# Altium schematic sheet Bridge.SchDoc
size A4
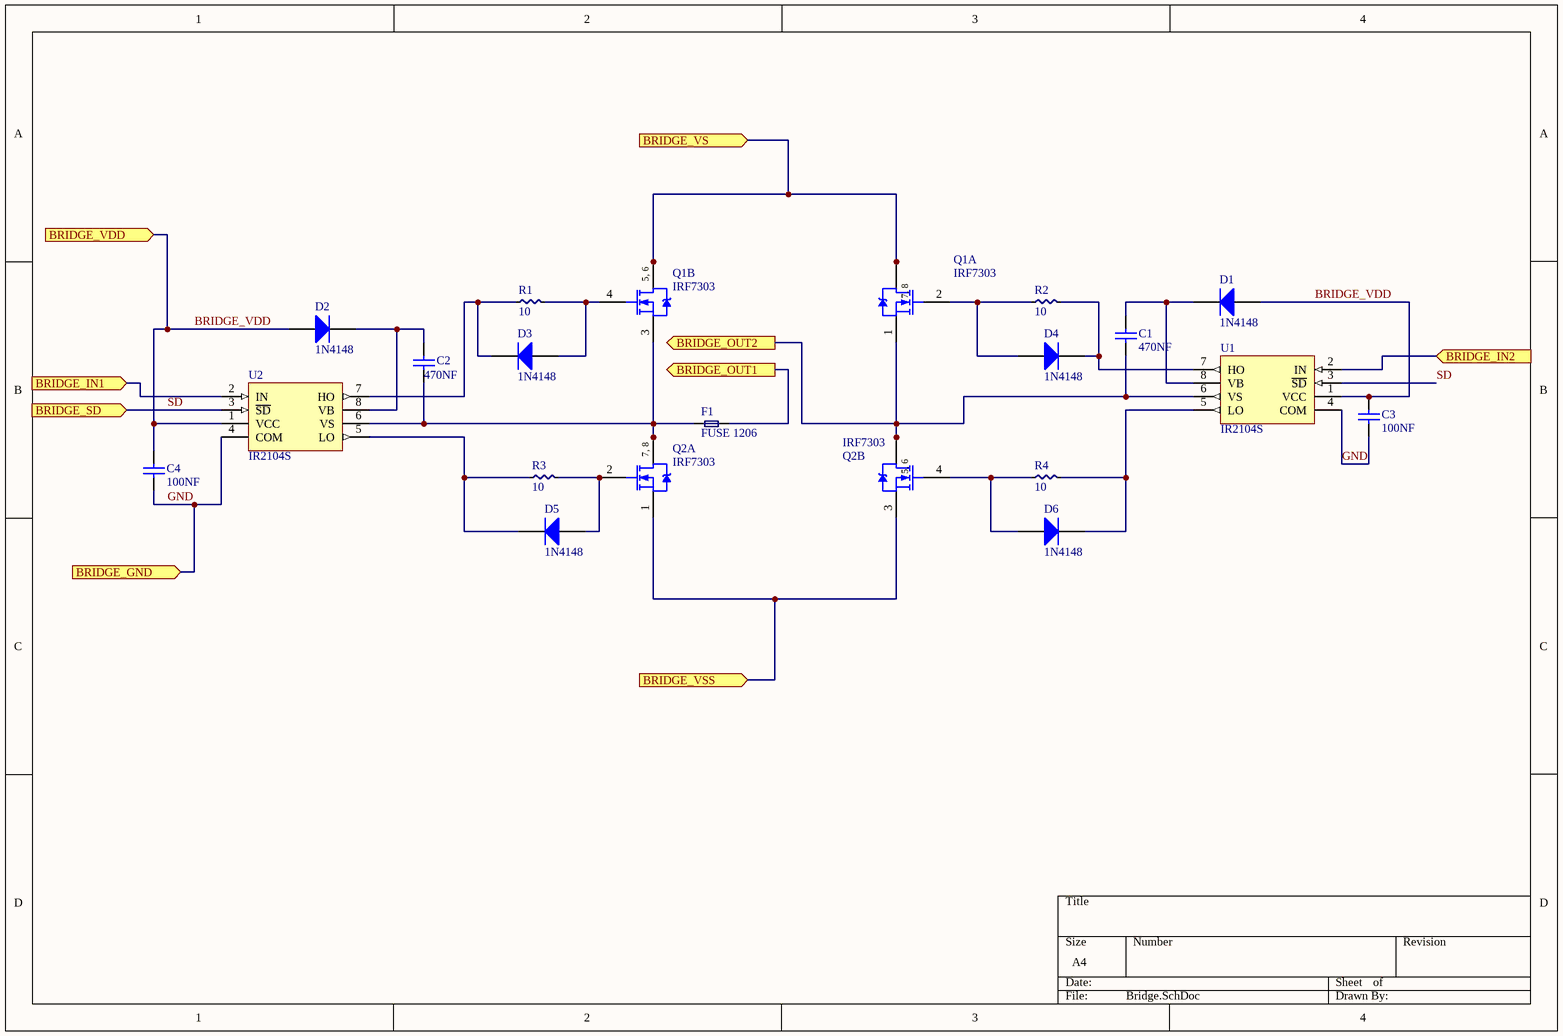
[diagram p0: Bridge.SchDoc]

## Parts
C1  470NF  [MY_CAP_SMD_1206]
C2  470NF  [MY_CAP_SMD_1206]
C3  100NF  [MY_CAP_SMD_0805]
C4  100NF  [MY_CAP_SMD_0805]
D1  1N4148  [MY_DIOD1N5822_SMD]
D2  1N4148  [MY_DIOD1N5822_SMD]
D3  1N4148  [MY_DIOD1N5822_SMD]
D4  1N4148  [MY_DIOD1N5822_SMD]
D5  1N4148  [MY_DIOD1N5822_SMD]
D6  1N4148  [MY_DIOD1N5822_SMD]
F1  FUSE 1206  [FUSE1206]
Q1  IRF7303  [SO-8_N]  (parts A,B of 2)
Q2  IRF7303  [SO-8_N]  (parts A,B of 2)
R1  10  [MY_RES_SMD_0805]
R2  10  [MY_RES_SMD_0805]
R3  10  [MY_RES_SMD_0805]
R4  10  [MY_RES_SMD_0805]
U1  IR2104S  [SO-8_N]
U2  IR2104S  [SO-8_N]

## Ports
BRIDGE_GND (in), BRIDGE_IN1 (in), BRIDGE_IN2 (in), BRIDGE_OUT1 (out), BRIDGE_OUT2 (out), BRIDGE_SD (in), BRIDGE_VDD (in), BRIDGE_VS (in), BRIDGE_VSS (in)

## Nets
BRIDGE_IN1: U2.2(IN) ; port BRIDGE_IN1
BRIDGE_IN2: U1.2(IN) ; port BRIDGE_IN2
BRIDGE_OUT1: F1.1 ; port BRIDGE_OUT1
BRIDGE_OUT2: C1.1 Q1.1(S) Q2.5(D) Q2.6(D) U1.6(VS) ; port BRIDGE_OUT2
BRIDGE_VDD: C3.2 C4.2 D1.A D2.A U1.1(VCC) U2.1(VCC) ; port BRIDGE_VDD
BRIDGE_VS: Q1.5(D) Q1.6(D) Q1.7(D) Q1.8(D) ; port BRIDGE_VS
BRIDGE_VSS: Q2.1(S) Q2.3(S) ; port BRIDGE_VSS
GND: C3.1 C4.1 U1.4(COM) U2.4(COM) ; port BRIDGE_GND
SD: U1.3(~{SD}) U2.3(~{SD}) ; port BRIDGE_SD
NetC1_2: C1.2 D1.K U1.8(VB)
NetC2_1: C2.1 F1.2 Q1.3(S) Q2.7(D) Q2.8(D) U2.6(VS)
NetC2_2: C2.2 D2.K U2.8(VB)
NetD3_A: D3.A Q1.4(G) R1.2
NetD3_K: D3.K R1.1 U2.7(HO)
NetD4_A: D4.A Q1.2(G) R2.1
NetD4_K: D4.K R2.2 U1.7(HO)
NetD5_A: D5.A Q2.2(G) R3.2
NetD5_K: D5.K R3.1 U2.5(LO)
NetD6_A: D6.A Q2.4(G) R4.1
NetD6_K: D6.K R4.2 U1.5(LO)

## Notes on the sheet
- (in symbol IRF7303, part A) 7, 8
- (in symbol IRF7303, part B) 5, 6

## Library data of the parts
C1 C2 = CAP SMD_1206: 3.2 mm × 1.6 mm
C3 C4 = CAP SMD_0805: 2.0 mm × 1.25 mm
D1-D6 = 1N5822-smd-5*2mm
Q1 Q2 = IRF7303: HEXFET Power MOSFET; Published: 8-Jun-2000; LatestRevisionDate: 13-Apr-2006; LatestRevisionNote: IPC-7351 Footprint Added.; DatasheetVersion: Aug-1997; PackageVersion: Feb-2001; PackageReference: SO-8; Publisher: Altium Limited; PackageDescription: 8-Pin Plastic Small Outline Integrated Circuit 1.27 mm Pitch; Code_JEDEC: MS-012-AA; Code_IPC: SOIC127P600-8; ComponentLink1Description: Manufacturer Link; ComponentLink1URL: http://www.irf.com/; ComponentLink2Description: Datasheet; ComponentLink2URL: http://www.irf.com/product-info/datasheets/data/irf7303.pdf
R1-R4 = RES SMD 0805
U1 U2 = IR2104S: High and Low Side Driver; Published: 8-Jun-2000; LatestRevisionDate: 13-Apr-2006; LatestRevisionNote: IPC-7351 Footprint Added.; DatasheetVersion: PD600461; PackageVersion: Feb-2001; PackageReference: SO-8; Publisher: Altium Limited; PackageDescription: 8-Pin Plastic Small Outline Integrated Circuit 1.27 mm Pitch; Code_JEDEC: MS-012-AA; Code_IPC: SOIC127P600-8; ComponentLink1Description: Manufacturer Link; ComponentLink1URL: http://www.irf.com/; ComponentLink2Description: Datasheet; ComponentLink2URL: http://www.irf.com/product-info/datasheets/data/ir2104.pdf